# EAGLE design miniwhip (EAGLE 9.6.2)
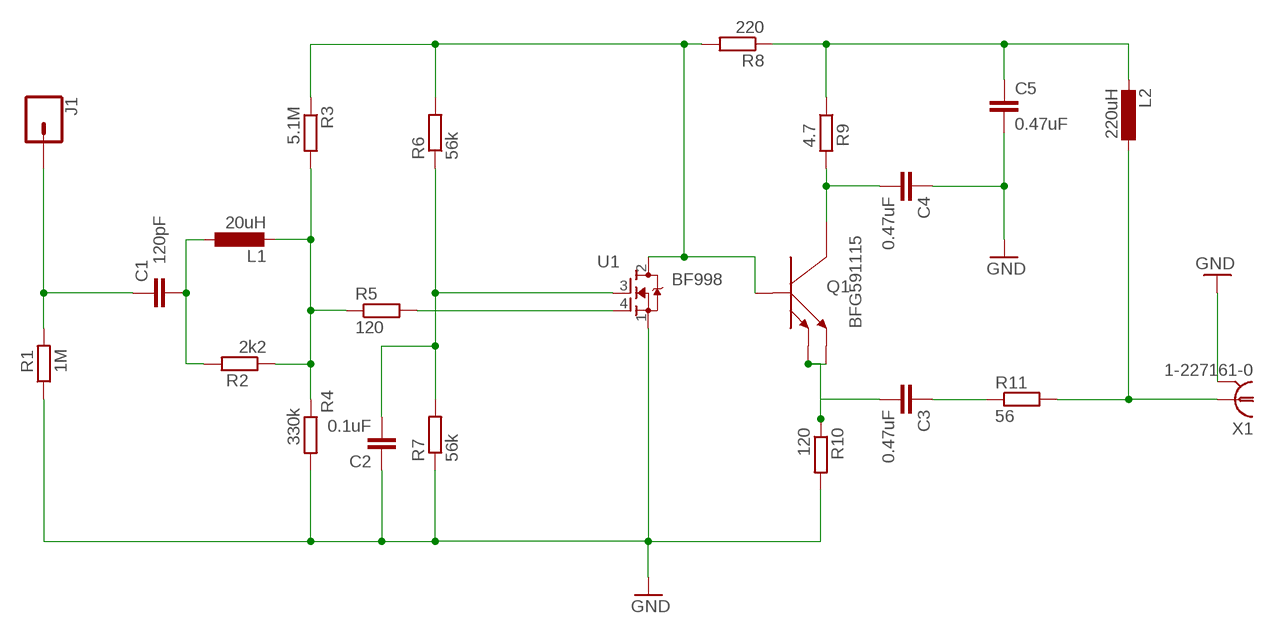
[diagram p0: schematic, sheet 1]

## Parts
C1  120pF  C-EUC0805  [C0805]
C2  0.1uF  C-EUC0805K  [C0805K]
C3  0.47uF  C-EUC0805K  [C0805K]
C4  0.47uF  C-EUC0805K  [C0805K]
C5  0.47uF  C-EUC0805K  [C0805K]
J1  CONN_01PTH_2MM  [1X01_2MM]
L1  20uH  L-EUL1812  [L1812]
L2  220uH  L-EU0204/7  [0204/7]
Q1  BFG591115  [SOT230P700X180-4N]
R1  1M  R-EU_M0805  [M0805]
R2  2k2  R-EU_M0805  [M0805]
R3  5.1M  R-EU_0207/10  [0207/10]
R4  330k  R-EU_M0805  [M0805]
R5  120  R-EU_M0805  [M0805]
R6  56k  R-EU_M0805  [M0805]
R7  56k  R-EU_M0805  [M0805]
R8  220  R-EU_M0805  [M0805]
R9  4.7  R-EU_M0805  [M0805]
R10  120  R-EU_M0805  [M0805]
R11  56  R-EU_M0805  [M0805]
U1  BF998  [SOT190P230X110-4N]
X1  1-227161-0  [AMP_227161]

## Nets
GND: C2.1 C4.1 C5.2 R1.1 R4.2 R7.1 R10.2 U1.1(S) X1.2
N$1: C1.1 J1.1 R1.2
N$2: C1.2 L1.1 R2.2
N$3: L1.2 R2.1 R3.2 R4.1 R5.1
N$4: R5.2 U1.4(G1)
N$5: C2.2 R6.1 R7.2 U1.3(G)
N$6: C3.2 Q1.1(E1) Q1.3(E2) R10.1
N$7: L2.1 R11.2 X1.1
N$8: Q1.2(B) R3.1 R6.2 R8.2 U1.2(D)
N$9: C4.2 Q1.4(C) R9.2
N$10: C5.1 L2.2 R8.1 R9.1
N$11: C3.1 R11.1

## Library data of the parts
C1-C5 = rcl:C-EU: CAPACITOR, European symbol; SPICEPREFIX: C
J1 = SparkFun-Connectors:CONN_01: Single connection point. Often used as Generic Header-pin footprint for 0.1 inch spaced/style header connections On any of the 0.1 inch spaced packages, you can populate with these: Break Away Headers - Straight <https://www.sparkfun.com/products/116> (PRT-00116) Break Away Male Headers - Right Angle <https://www.sparkfun.com/products/553> (PRT-00553) Female Headers <https://www.sparkfun.com/products/115> (PRT-00115) Break Away Headers - Machine Pin <https://www.sparkfun.com/products/117> (PRT-00117) Break Away Female Headers - Swiss Machine Pin <https://www.sparkfun.com/products/743> (PRT-00743) This device is also useful as a general connection point to wire up your design to another part of your project. Our various solder wires solder well into these plated through hole pads. Hook-Up Wire - Assortment (Stranded, 22 AWG) <https://www.sparkfun.com/products/11375> (PRT-11375) Hook-Up Wire - Assortment (Solid Core, 22 AWG) <https://www.sparkfun.com/products/11367> (PRT-11367) View the entire wire category on our website here <https://www.sparkfun.com/categories/141> Special notes: SMTSO-256-ET is a "flush mount" nut for a 4-40 screw. We mostly use this on specialty testbeds; it is a nice way to connect hardware to your PCB at an adjustable hieght. Also note, the SNAP packages are for using a snappable style connector. We sell a baggie of snaps and they are also used on two LilyPad designs: Snap Assortment - 30 pack (male and female) <https://www.sparkfun.com/products/11347> (DEV-11347) LilyPad Arduino SimpleSnap <https://www.sparkfun.com/products/10941> (DEV-10941) LilyPad SimpleSnap Protoboard <https://www.sparkfun.com/products/10940> (DEV-10940)
L1 L2 = rcl:L-EU: INDUCTOR, European symbol; SPICEPREFIX: L
Q1 = BFG591115:BFG591115: NPN 7 GHz wideband transistor Check prices <https://pricing.snapeda.com/parts/BFG591115/NXP%20USA/view-part?ref=eda>; AVAILABILITY: Not in stock; DESCRIPTION: RF Transistor NPN 15V 200mA 7GHz 2W Surface Mount SOT-223; MF: NXP USA; MP: BFG591115; PACKAGE: TO-261-4 NXP USA; PRICE: None
R1-R11 = rcl:R-EU_: RESISTOR, European symbol; SPICEPREFIX: R
U1 = BF998:BF998: Trans RF MOSFET N-CH 12V 0.03A 4-Pin(3+Tab) SOT-143B Check prices <https://pricing.snapeda.com/parts/BF998/Infineon%20Technologies/view-part?ref=eda>; AVAILABILITY: In Stock; DESCRIPTION: RF Mosfet N-Channel 8V 10mA 45MHz 28dB PG-SOT-143-3D; MF: Infineon Technologies; MP: BF998; PACKAGE: SOT-143 NXP Semiconductors; PRICE: None; PURCHASE-URL: https://pricing.snapeda.com/search/part/BF998/?ref=eda
X1 = con-coax:?227161*: JACK, RIGHT ANGLE, 50 OHM, PCB, BNC Source: amp_227161.pdf; MF: TYCO ELECTRONICS; MPN: 1-227161; OC_FARNELL: unknown; OC_NEWARK: 33B3200

## Board
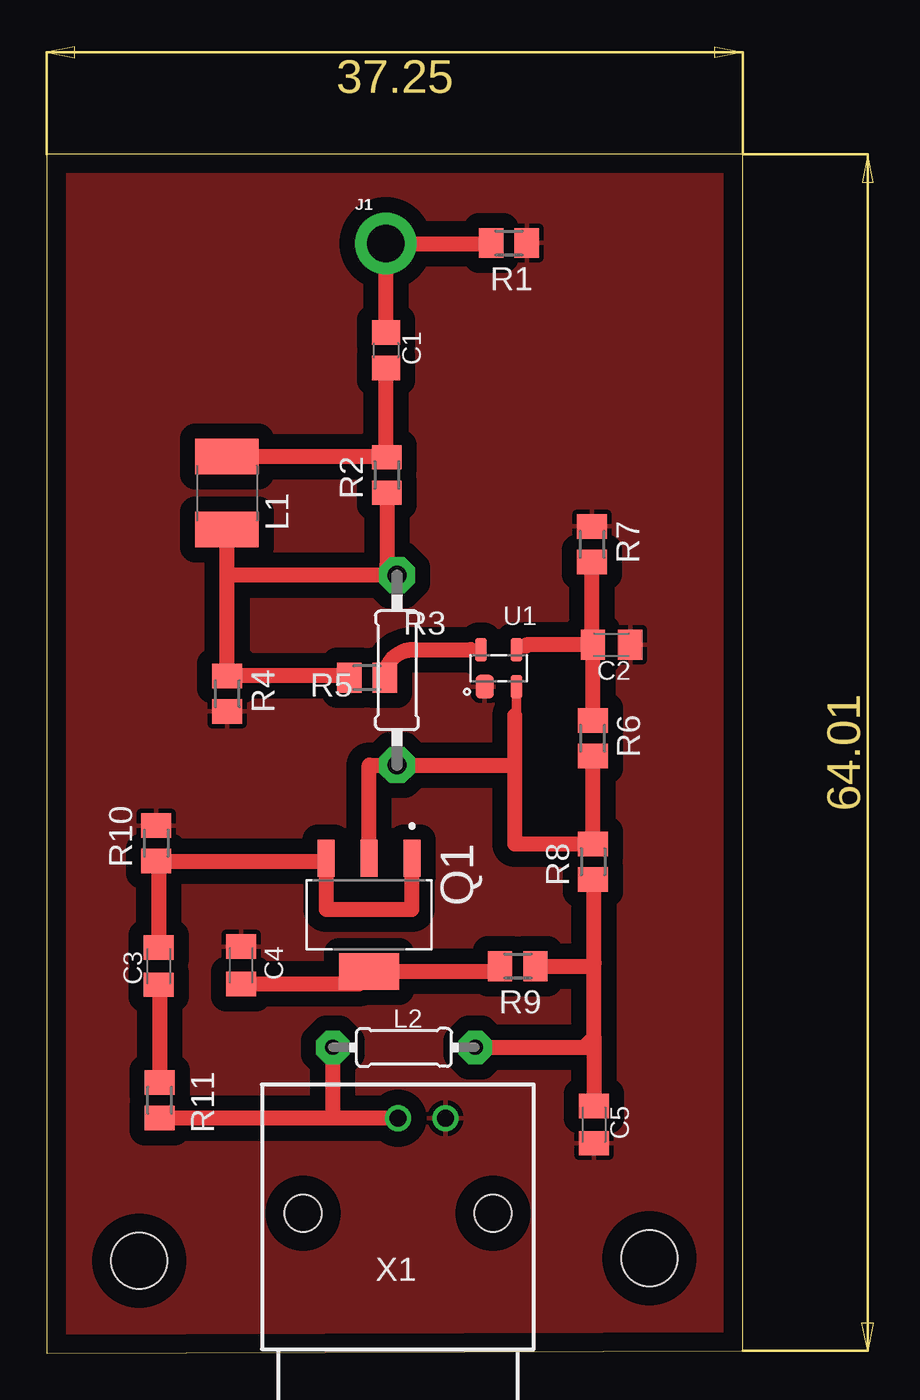
[diagram p1: board, top side]

Size 37.25 x 64.14 mm. Coordinates in mm from the lower left corner, seen from the top.
Outline: 0,0 37.25,0.13 37.25,64.14 0,64.14 0,0
Copper layers (1*16): Top 0.035mm / dielectric 1.5mm / Bottom 0.035mm
Design rules "default": minimum track width 6mil, minimum drill 0.35mm, track to track 6mil, track to pad 6mil, pad to pad 6mil, via to via 6mil, smd to smd 6mil, copper to edge 40mil, drill to drill 6mil, minimum pad ring 10mil, minimum via ring 8mil, stop-mask expansion 4mil, vias tented up to drill 0mil, thermal gap 10mil
Holes 3 mm at 4.95,4.95 32.26,5.08

### Footprints (pad centres in the part's own frame; a part is rotated, then mirrored left to right if it is on the bottom)
C0805 = smd 1.3 x 1.5: 1 -0.95,0; 2 0.95,0
C0805K = smd 1.3 x 1.6: 1 -1,0; 2 1,0
1X01_2MM = drill 2 pad 3.302: 1 0,0
L1812 = smd 1.9 x 3.4: 1 -1.95,0; 2 1.95,0
0204/7 = drill 0.813 pad 1.778 octagon: 1 -3.81,0; 2 3.81,0
SOT230P700X180-4N = smd 1.97 x 0.89: 1 -3.025,2.3; 2 -3.025,0; 3 -3.025,-2.3 | smd 1.97 x 3.19: 4 3.025,0
M0805 = smd 1.3 x 1.6: 1 -0.95,0; 2 0.95,0
0207/10 = drill 1 pad 1.905 octagon: 1 -5.08,0; 2 5.08,0
SOT190P230X110-4N = smd 1.26 x 0.99: 1 -0.98,0.75 | smd 1.26 x 0.59: 2 -0.98,-0.95; 3 1,-0.95; 4 1,0.95
AMP_227161 = drill 0.9 pad 1.27: 1 0,-5.08; 2 -2.54,-5.08 | hole 2: -5.08,0; 5.08,0

### Placement (x,y rotation side)
C1  18.16,53.66 270 top
C2  30.23,37.9 180 top
C3  6,20.71 90 top
C4  10.4,20.76 270 top
C5  29.29,12.23 270 top
J1  18.15,59.37 0 top
L1  9.65,46.02 270 top
L2  19.12,16.36 0 top
Q1  17.25,23.45 270 top
R1  24.75,59.4 180 top
R2  18.2,46.99 90 top
R3  18.75,36.54 90 top
R4  9.67,35.29 270 top
R5  17.15,36.14 0 top
R6  29.23,32.9 270 top
R7  29.19,43.28 270 top
R8  29.24,26.29 90 top
R9  25.21,20.71 180 top
R10  5.86,27.28 90 top
R11  6.05,13.54 270 top
U1  24.2,36.64 90 top
X1  18.8,7.49 180 top

### Tracks (layer width: path | path; a pad name or v marks a point on that pad's centre or on a via)
GND
  pour Top (isolate 0.813): -2,70.75 -2,-2.5 51,-2.5 51,70.75
N$1
  Top 0.813: C1.1 18.16,59.36 arc90 J1.1 23.77,59.37 arc90 R1.2
N$2
  Top 0.813: L1.1 18.17,47.97 R2.2 arc90 18.16,47.98 C1.2
N$3
  Top 0.813: R5.1 16.2,36.24 R4.1 9.67,41.78 | R2.1 18.2,42.17 R3.2 9.83,41.62 arc-90 9.67,41.78 | 9.67,41.78 9.67,44.05 L1.2
N$4
  Top 0.61: 22.71,37.64 U1.4 | U1.4 arc90 U1.4
  Top 0.813: R5.2 arc-90 19.61,37.64 22.71,37.64
N$5
  Top 0.406: 25.65,37.85 arc-90 25.45,37.64 U1.3
  Top 0.813: R6.1 C2.2 | C2.2 29.19,37.94 R7.2 | C2.2 25.7,37.9 arc90 25.65,37.85
N$6
  Top 0.813: Q1.1 19.55,23.75 14.95,23.75 Q1.3 14.95,26.33 R10.1 6,26.19 C3.2
N$7
  Top 0.813: X1.1 15.24,12.57 | 15.24,12.57 6.07,12.57 R11.2 | L2.1 15.31,12.65 15.24,12.57
N$8
  Top 0.508: U1.2 25.14,34.21 25.05,34.12
  Top 0.813: Q1.2 17.25,31.46 R3.1 25.05,31.46 | 25.05,31.46 25.05,34.12 | 25.05,31.46 25.05,27.24 R8.2 29.24,31.93 R6.2
N$9
  Top 0.813: R9.2 24.26,20.43 Q1.4 arc-90 16.58,19.76 C4.2
N$10
  Top 0.813: 29.29,16.87 C5.1 | 29.29,16.87 29.29,20.87 | 29.29,20.87 29.29,25.29 R8.1 | R9.1 29.13,20.71 29.29,20.87 | L2.2 28.78,16.36 29.29,16.87
N$11
  Top 0.813: C3.1 6.05,19.66 R11.1